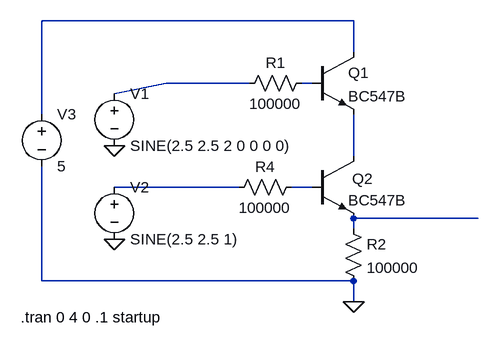
[diagram p0: schematic AndGate-MP.asc]
AndGate-MP.asc, the LTspice schematic file:
Version 4
SHEET 1 2268 680
WIRE -400 -144 -880 -144
WIRE -400 -96 -400 -144
WIRE -560 -48 -688 -48
WIRE -464 -48 -480 -48
WIRE -768 -32 -688 -48
WIRE -880 0 -880 -144
WIRE -400 64 -400 0
WIRE -576 112 -768 112
WIRE -464 112 -496 112
WIRE -208 160 -400 160
WIRE -400 176 -400 160
WIRE -880 256 -880 80
WIRE -400 256 -880 256
WIRE -400 288 -400 256
FLAG -400 288 0
FLAG -768 48 0
FLAG -768 192 0
SYMBOL npn -464 -96 R0
SYMATTR InstName Q1
SYMATTR Value BC547B
SYMBOL npn -464 64 R0
WINDOW 0 62 35 Left 2
SYMATTR InstName Q2
SYMATTR Value BC547B
SYMBOL res -576 -32 R270
WINDOW 0 32 56 VTop 2
WINDOW 3 0 56 VBottom 2
SYMATTR InstName R1
SYMATTR Value 100000
SYMBOL res -592 128 R270
WINDOW 0 32 56 VTop 2
WINDOW 3 0 56 VBottom 2
SYMATTR InstName R4
SYMATTR Value 100000
SYMBOL voltage -880 -16 R0
WINDOW 123 0 0 Left 0
WINDOW 39 0 0 Left 0
SYMATTR InstName V3
SYMATTR Value 5
SYMBOL res -416 160 R0
SYMATTR InstName R2
SYMATTR Value 100000
SYMBOL voltage -768 -48 R0
WINDOW 123 0 0 Left 0
WINDOW 39 0 0 Left 0
SYMATTR InstName V1
SYMATTR Value SINE(2.5 2.5 2 0 0 0 0)
SYMBOL voltage -768 96 R0
WINDOW 123 0 0 Left 0
WINDOW 39 0 0 Left 0
SYMATTR InstName V2
SYMATTR Value SINE(2.5 2.5 1)
TEXT -912 312 Left 2 !.tran 0 4 0 .1 startup

The netlist it stands for:
* AndGate-MP.asc
Q1 N001 N003 N004 0 BC547B
Q2 N004 N006 N007 0 BC547B
R1 N002 N003 100000
R4 N005 N006 100000
V3 N001 0 5
R2 N007 0 100000
V1 N002 0 SINE(2.5 2.5 2 0 0 0 0)
V2 N005 0 SINE(2.5 2.5 1)
.model NPN NPN
.model PNP PNP
.lib standard.bjt
.tran 0 4 0 .1 startup
.backanno
.end